# EAGLE design PIC_assembler_proto (EAGLE 9.6.0)
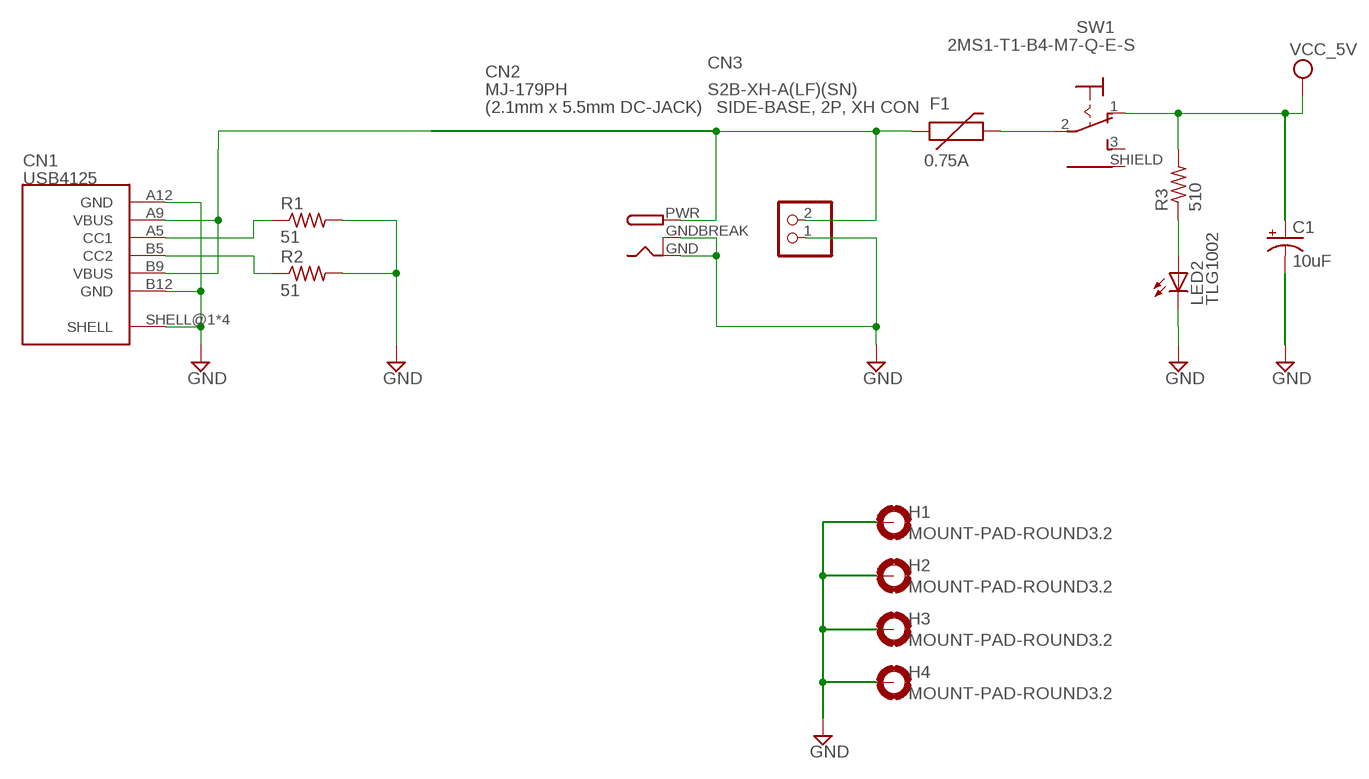
[diagram p0: schematic, sheet 1, part 1 of 2]
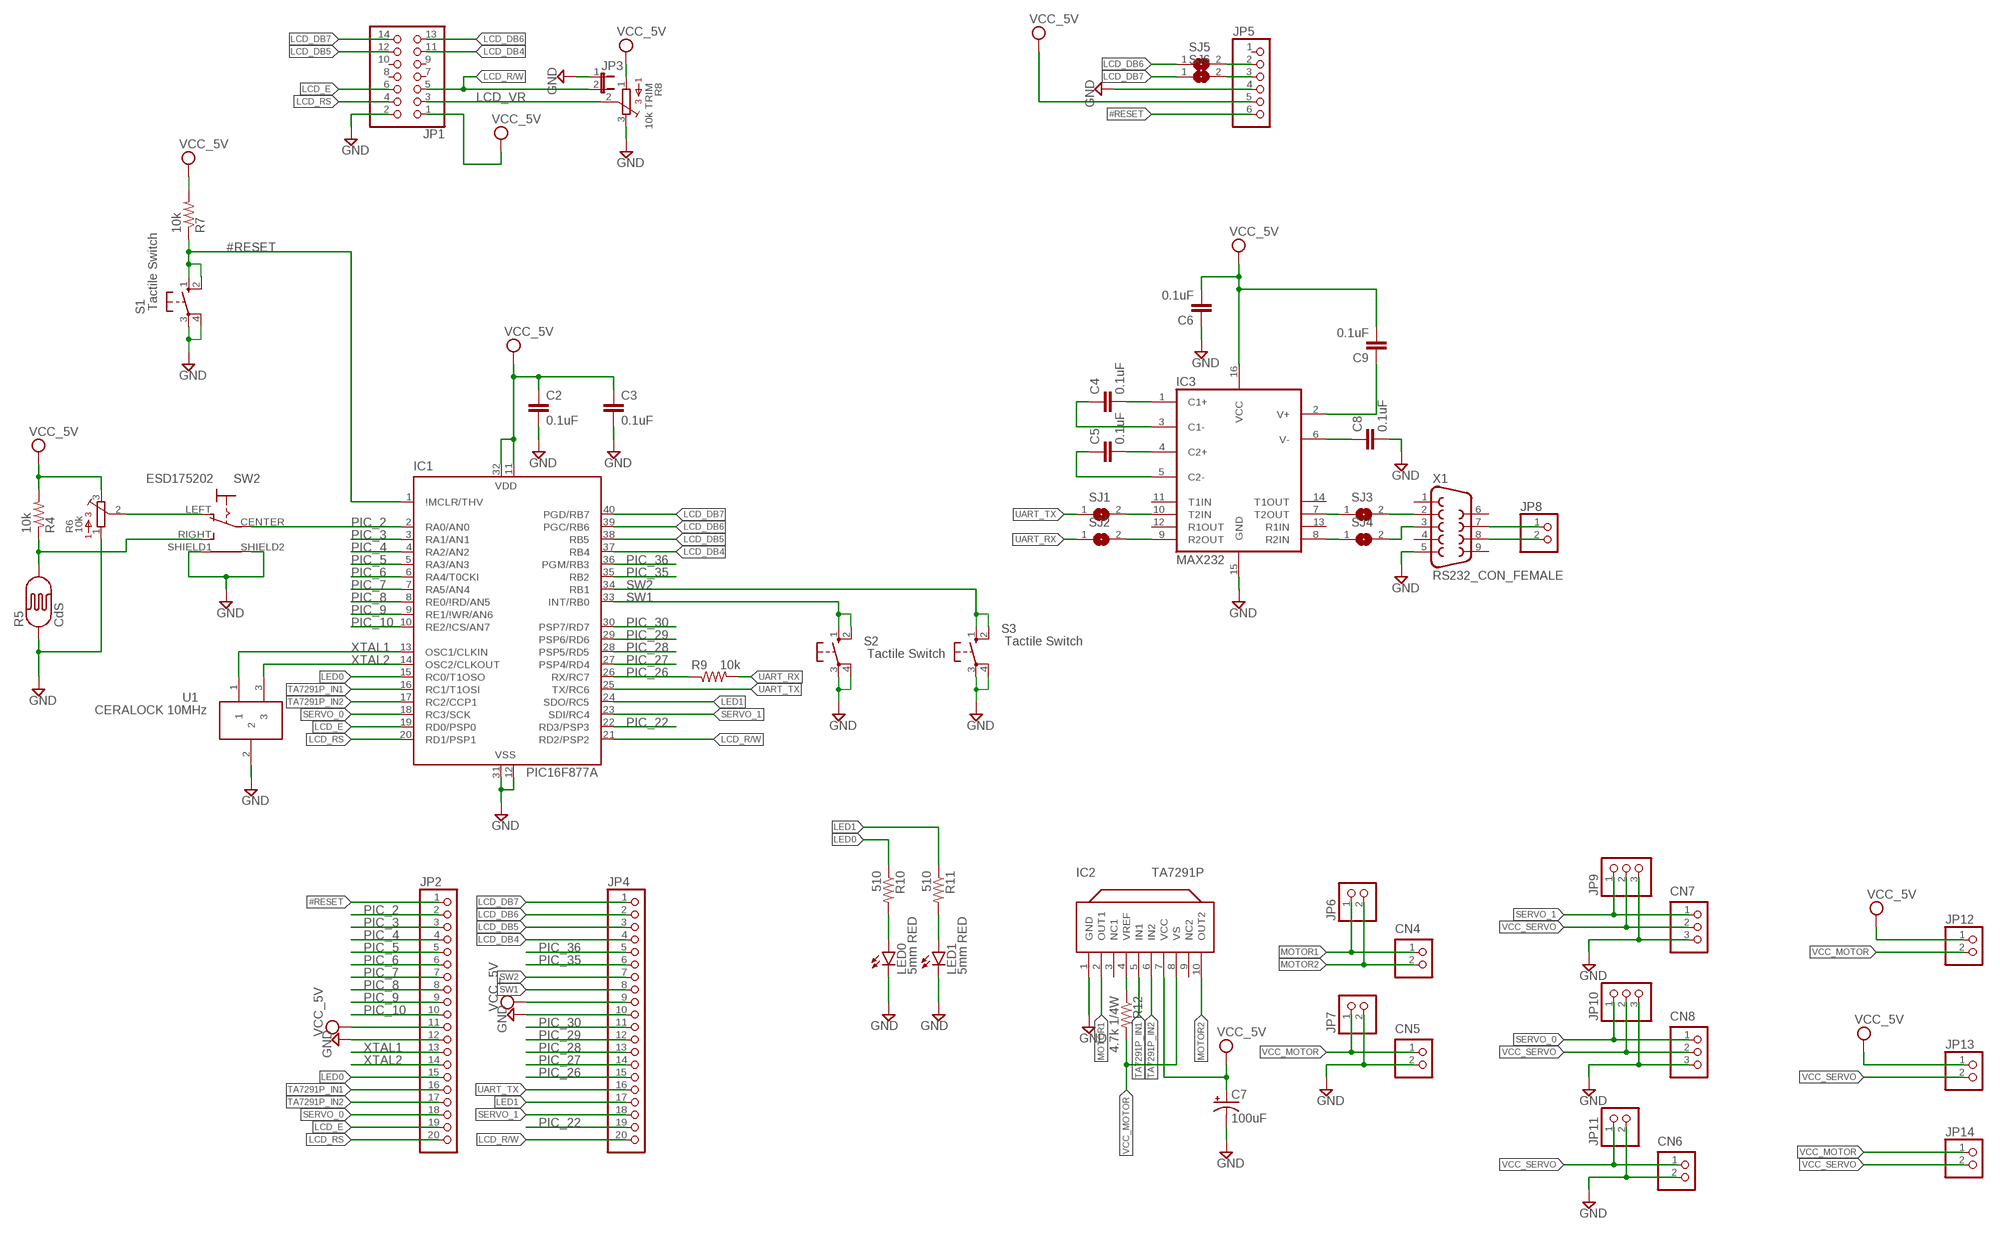
[diagram p1: schematic, sheet 1, part 2 of 2]

## Parts
C1  10uF  CPOL-USE2.5-7  [E2,5-7]
C2  0.1uF  C-EU050-025X075  [C050-025X075]
C3  0.1uF  C-EU050-025X075  [C050-025X075]
C4  0.1uF  C-EU050-025X075  [C050-025X075]
C5  0.1uF  C-EU050-025X075  [C050-025X075]
C6  0.1uF  C-EU050-025X075  [C050-025X075]
C7  100uF  CPOL-USE2.5-7  [E2,5-7]
C8  0.1uF  C-EU050-025X075  [C050-025X075]
C9  0.1uF  C-EU050-025X075  [C050-025X075]
CN1  USB4125  [USB4215]
CN2  MJ-179PH  DCBARREL  [DCJACK_2MM_THIN_18742]
CN3  S2B-XH-A(LF)(SN)  B2B-XH-A  [B2B-XH-A]
CN4  S2B-XH-A  [S2B-XH-A]
CN5  S2B-XH-A  [S2B-XH-A]
CN6  S2B-XH-A  [S2B-XH-A]
CN7  S3B-XH-A  [S3B-XH-A]
CN8  S3B-XH-A  [S3B-XH-A]
F1  0.75A  PTCPTH  [PTC]
H1  MOUNT-PAD-ROUND3.2  [3,2-PAD]
H2  MOUNT-PAD-ROUND3.2  [3,2-PAD]
H3  MOUNT-PAD-ROUND3.2  [3,2-PAD]
H4  MOUNT-PAD-ROUND3.2  [3,2-PAD]
IC1  PIC16F877A  PIC16F877P  [DIL40]
IC2  TA7291P  [SIL10]
IC3  MAX232  MAX232PTH  [DIL16]
JP1  PINHD-2X7  [2X07]
JP2  PINHD-1X20  [1X20]
JP3  JUMPER-2PTH  [1X02]
JP4  PINHD-1X20  [1X20]
JP5  PINHD-1X6/90  [1X06/90]
JP6  PINHD-1X2  [1X02]
JP7  PINHD-1X2  [1X02]
JP8  PINHD-1X2  [1X02]
JP9  PINHD-1X3  [1X03]
JP10  PINHD-1X3  [1X03]
JP11  PINHD-1X2  [1X02]
JP12  PINHD-1X2  [1X02]
JP13  PINHD-1X2  [1X02]
JP14  PINHD-1X2  [1X02]
LED0  5mm RED  LED5MM  [LED5MM]
LED1  5mm RED  LED5MM  [LED5MM]
LED2  TLG1002  LEDCHIPLED_0805  [CHIPLED_0805]
R1  51  R-US_R0603  [R0603]
R2  51  R-US_R0603  [R0603]
R3  510  R-US_0207/10  [0207/10]
R4  10k  R-US_0207/10  [0207/10]
R5  CdS  PHOTOCELLPTH  [PHOTOCELL]
R6  10k  3362P  [3362P]
R7  10k  R-US_0207/10  [0207/10]
R8  10k TRIM  3362P  [3362P]
R9  10k  R-US_0207/10  [0207/10]
R10  510  R-US_0207/10  [0207/10]
R11  510  R-US_0207/10  [0207/10]
R12  4.7k 1/4W  R-US_0207/10  [0207/10]
S1  Tactile Switch  10-XX  [B3F-10XX]
S2  Tactile Switch  10-XX  [B3F-10XX]
S3  Tactile Switch  10-XX  [B3F-10XX]
SJ1  SJ  [SJ]
SJ2  SJ  [SJ]
SJ3  SJ  [SJ]
SJ4  SJ  [SJ]
SJ5  SJ  [SJ]
SJ6  SJ  [SJ]
SW1  2MS1-T1-B4-M7-Q-E-S  [2MS1-T1-B4-M7-Q-E-S]
SW2  ESD175202  [ESD175202]
U1  CERALOCK 10MHz  CERALOCK  [CERALOCK]
X1  RS232_CON_FEMALE  DB9FEMALE  [DB9]

## Nets
#RESET: IC1.1(\!MCLR/THV) JP2.1 JP5.6 R7.1 S1.1(S) S1.2(S1)
GND: C1.- C2.2 C3.2 C6.1 C7.- C8.2 CN1.A12(GND) CN1.B12(GND) CN1.SHELL@1(SHELL) CN1.SHELL@2(SHELL) CN1.SHELL@3(SHELL) CN1.SHELL@4(SHELL) CN2.GND CN2.GNDBREAK CN3.1 CN5.2 CN6.2 CN7.3 CN8.3 H1.B3,2(MOUNT) H2.B3,2(MOUNT) H3.B3,2(MOUNT) H4.B3,2(MOUNT) IC1.12(VSS) IC1.31(VSS) IC2.1(GND) IC3.15(GND) JP1.2 JP2.12 JP3.1 JP4.10 JP5.4 JP7.2 JP9.3 JP10.3 JP11.2 LED0.K(C) LED1.K(C) LED2.C R1.2 R2.2 R5.1 R6.1 R8.3 S1.3(P) S1.4(P1) S2.3(P) S2.4(P1) S3.3(P) S3.4(P1) SW2.SHIELD1 SW2.SHIELD2 U1.2 X1.5
LCD_DB4: IC1.37(RB4) JP1.11 JP4.4
LCD_DB5: IC1.38(RB5) JP1.12 JP4.3
LCD_DB6: IC1.39(PGC/RB6) JP1.13 JP4.2 SJ5.1
LCD_DB7: IC1.40(PGD/RB7) JP1.14 JP4.1 SJ6.1
LCD_E: IC1.19(RD0/PSP0) JP1.6 JP2.19
LCD_R/W: IC1.21(RD2/PSP2) JP1.5 JP3.2 JP4.20
LCD_RS: IC1.20(RD1/PSP1) JP1.4 JP2.20
LCD_VR: JP1.3 R8.2
LED0: IC1.15(RC0/T1OSO) JP2.15 R10.1
LED1: IC1.24(SDO/RC5) JP4.17 R11.1
MOTOR1: CN4.1 IC2.2(OUT1) JP6.1
MOTOR2: CN4.2 IC2.10(OUT2) JP6.2
N$1: JP8.1 X1.7
N$2: SJ3.2 X1.2
N$3: IC3.9(R2OUT) SJ2.2
N$4: R4.1 R5.2 SW2.RIGHT(O2)
N$5: R6.2 SW2.LEFT(O1)
N$6: IC3.8(R2IN) SJ4.1
N$7: F1.P$2 SW1.2(2COMM)
N$8: IC3.10(T2IN) SJ1.2
N$9: JP8.2 X1.8
N$10: IC2.4(VREF) R12.1
N$11: JP5.2 SJ5.2
N$12: IC3.7(T2OUT) SJ3.1
N$13: JP5.3 SJ6.2
N$14: SJ4.2 X1.3
N$15: LED0.A R10.2
N$16: LED1.A R11.2
N$17: C9.1 IC3.2(V+)
N$18: C8.1 IC3.6(V-)
N$20: C5.2 IC3.4(C2+)
N$21: C5.1 IC3.5(C2-)
N$22: C4.1 IC3.3(C1-)
N$23: C4.2 IC3.1(C1+)
N$24: CN1.A9(VBUS) CN1.B9(VBUS) CN2.PWR CN3.2 F1.P$1
N$27: LED2.A R3.1
N$66: CN1.B5(CC2) R2.1
N$67: CN1.A5(CC1) R1.1
PIC_2: IC1.2(RA0/AN0) JP2.2 SW2.CENTER(COMMON)
PIC_3: IC1.3(RA1/AN1) JP2.3
PIC_4: IC1.4(RA2/AN2) JP2.4
PIC_5: IC1.5(RA3/AN3) JP2.5
PIC_6: IC1.6(RA4/T0CKI) JP2.6
PIC_7: IC1.7(RA5/AN4) JP2.7
PIC_8: IC1.8(RE0/\!RD/AN5) JP2.8
PIC_9: IC1.9(RE1/\!WR/AN6) JP2.9
PIC_10: IC1.10(RE2/\!CS/AN7) JP2.10
PIC_22: IC1.22(RD3/PSP3) JP4.19
PIC_26: IC1.26(RX/RC7) JP4.15 R9.1
PIC_27: IC1.27(PSP4/RD4) JP4.14
PIC_28: IC1.28(PSP5/RD5) JP4.13
PIC_29: IC1.29(PSP6/RD6) JP4.12
PIC_30: IC1.30(PSP7/RD7) JP4.11
PIC_35: IC1.35(RB2) JP4.6
PIC_36: IC1.36(PGM/RB3) JP4.5
SERVO_0: CN8.1 IC1.18(RC3/SCK) JP2.18 JP10.1
SERVO_1: CN7.1 IC1.23(SDI/RC4) JP4.18 JP9.1
SW1: IC1.33(INT/RB0) JP4.8 S2.1(S) S2.2(S1)
SW2: IC1.34(RB1) JP4.7 S3.1(S) S3.2(S1)
TA7291P_IN1: IC1.16(RC1/T1OSI) IC2.5(IN1) JP2.16
TA7291P_IN2: IC1.17(RC2/CCP1) IC2.6(IN2) JP2.17
UART_RX: R9.2 SJ2.1
UART_TX: IC1.25(TX/RC6) JP4.16 SJ1.1
VCC_5V: C1.+ C2.1 C3.1 C6.2 C7.+ C9.2 IC1.11(VDD) IC1.32(VDD) IC2.7(VCC) IC3.16(VCC) JP1.1 JP2.11 JP4.9 JP5.5 JP12.1 JP13.1 R3.2 R4.2 R6.3 R7.2 R8.1 SW1.1
VCC_MOTOR: CN5.1 IC2.8(VS) JP7.1 JP12.2 JP14.1 R12.2
VCC_SERVO: CN6.1 CN7.2 CN8.2 JP9.2 JP10.2 JP11.1 JP13.2 JP14.2
XTAL1: IC1.13(OSC1/CLKIN) JP2.13 U1.1
XTAL2: IC1.14(OSC2/CLKOUT) JP2.14 U1.3
Unconnected: IC2.3(NC1) IC2.9(NC2) IC3.11(T1IN) IC3.12(R1OUT) IC3.13(R1IN) IC3.14(T1OUT) JP1.7 JP1.8 JP1.9 JP1.10 JP5.1 SW1.3 SW1.SHIELD X1.1 X1.4 X1.6 X1.9

## Notes on the sheet
- (2.1mm x 5.5mm DC-JACK) | SIDE-BASE, 2P, XH CON

## Library data of the parts
C1 C7 = rcl:CPOL-US: POLARIZED CAPACITOR, American symbol; SPICEPREFIX: C
C2-C6 C8 C9 = rcl:C-EU: CAPACITOR, European symbol; SPICEPREFIX: C
CN1 = 11MyLib:USB4125: USB4125-GF-A-0190 USB Type-C Power only Series Connector Charging Only, 3A, Top mount, Horizontal, 6-pin Available in Digikey https://mm.digikey.com/Volume0/opasdata/d220001/medias/docus/5337/USB_Type-C_Selection_Guide.pdf https://www.digikey.jp/ja/products/detail/gct/USB4125-GF-A-0190/14559038
CN2 = 11MyLib:DCBARREL: 2.0mm DC Barrel Jack DCJACK_2MM_PTH - Through Hole Jack (4UConnector: 05537)
CN3 = jst-xh:B2B-XH-A: Wire-to-Board 2.5mm pitch top mount connector Source: http://www.jst-mfg.com/product/pdf/jpn/XH.pdf http://www.jst-mfg.com/product/detail.php?series=277
CN4-CN6 = jst-xh:S2B-XH-A: Wire-to-Board 2.5mm pitch side mount connector Source: http://www.jst-mfg.com/product/pdf/jpn/XH.pdf http://www.jst-mfg.com/product/detail.php?series=277
CN7 CN8 = jst-xh:S3B-XH-A: Wire-to-Board 2.5mm pitch side mount connector Source: http://www.jst-mfg.com/product/pdf/jpn/XH.pdf http://www.jst-mfg.com/product/detail.php?series=277
F1 = SparkFun-PowerIC:PTC: Resettable Fuse PTC Resettable Fuse. Spark Fun Electronics SKU : COM-08357
H1-H4 = holes:MOUNT-PAD-ROUND: MOUNTING PAD, round
IC1 = microchip-update-2:PIC16F87*: MICROCONTROLLER
IC2 = 11MyLib:TA7291P
IC3 = SparkFun-DigitalIC:MAX232: RS232 Transceiver Very common IC. This is generically called 'MAX232', but works with the 3V equivalent MAX3232 generic ICs. Field tested and mother approved. Spark Fun Electronics SKU : COM-00316 (DIP) and COM-00589 (SMD)
JP1 = pinhead:PINHD-2X7: PIN HEADER
JP2 JP4 = pinhead:PINHD-1X20: PIN HEADER
JP3 = SparkFun-Passives:JUMPER-2: Jumper Basic 0.1" spaced jumper. Use with breakaway headers.
JP5 = pinhead:PINHD-1X6: PIN HEADER
JP6-JP8 JP11-JP14 = pinhead:PINHD-1X2: PIN HEADER
JP9 JP10 = pinhead:PINHD-1X3: PIN HEADER
LED0 LED1 = led:LED: LED
LED2 = adafruit:LED: LED
R1-R4 R7 R9 = 11MyLib:R-US_: RESISTOR, American symbol
R5 = SparkFun-Sensors:PHOTOCELL: CdS photoresistor. This is a low cost way to detect light levels. Resistance decreases with more incoming light. SparkFun SKU: SEN-09088
R6 R8 = bourns:3362: 3362 Series 1/4" Square Trimmer
R10-R12 = rcl:R-US_: RESISTOR, American symbol; SPICEPREFIX: R
S1-S3 = switch-omron:10-XX: OMRON SWITCH; MPN: B3F-1000; OC_FARNELL: 176432; OC_NEWARK: 36M3542
SJ1-SJ6 = jumper:SJ: SMD solder JUMPER
SW1 = 11MyLib:2MS1-T1-B4-M7-Q-E-S: Toggle SW Alternate
SW2 = 11MyLib:ESD175202
U1 = ceralock:CERALOCK
X1 = SparkFun-Connectors:DB9: DB9 Connector Standard DB9 (D-Sub 9) serial connector. Can be used for CAN bus as well as RS485 and RS232. Footprint production proven. Spark Fun Electronics SKU : PRT-00429

## Board
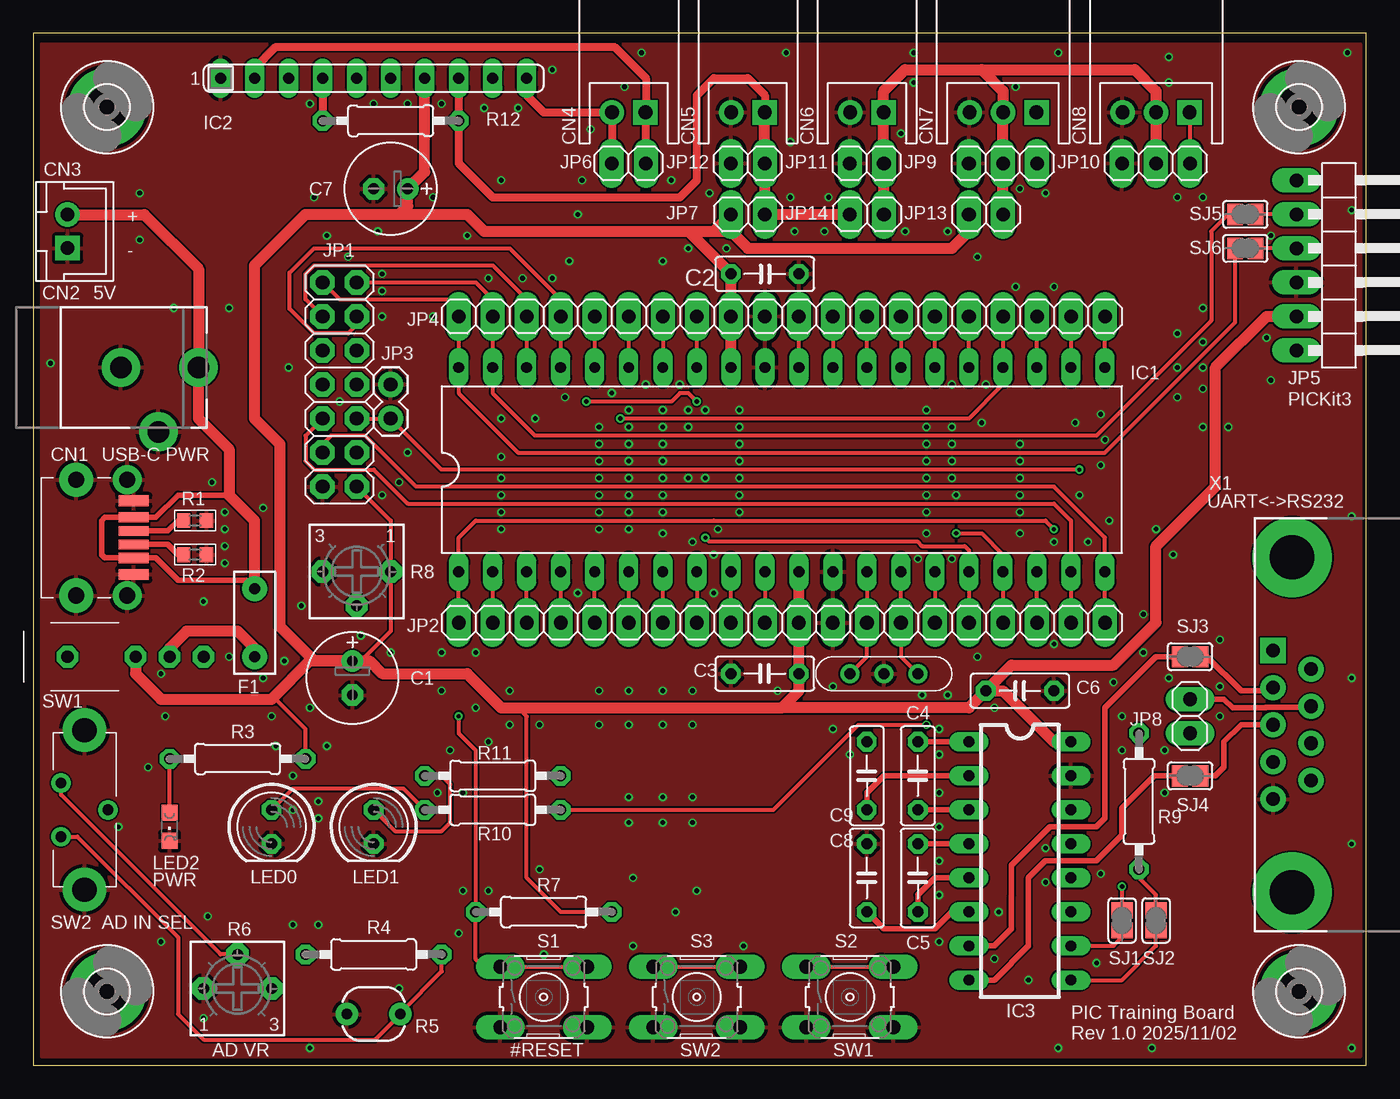
[diagram p2: board, top side]
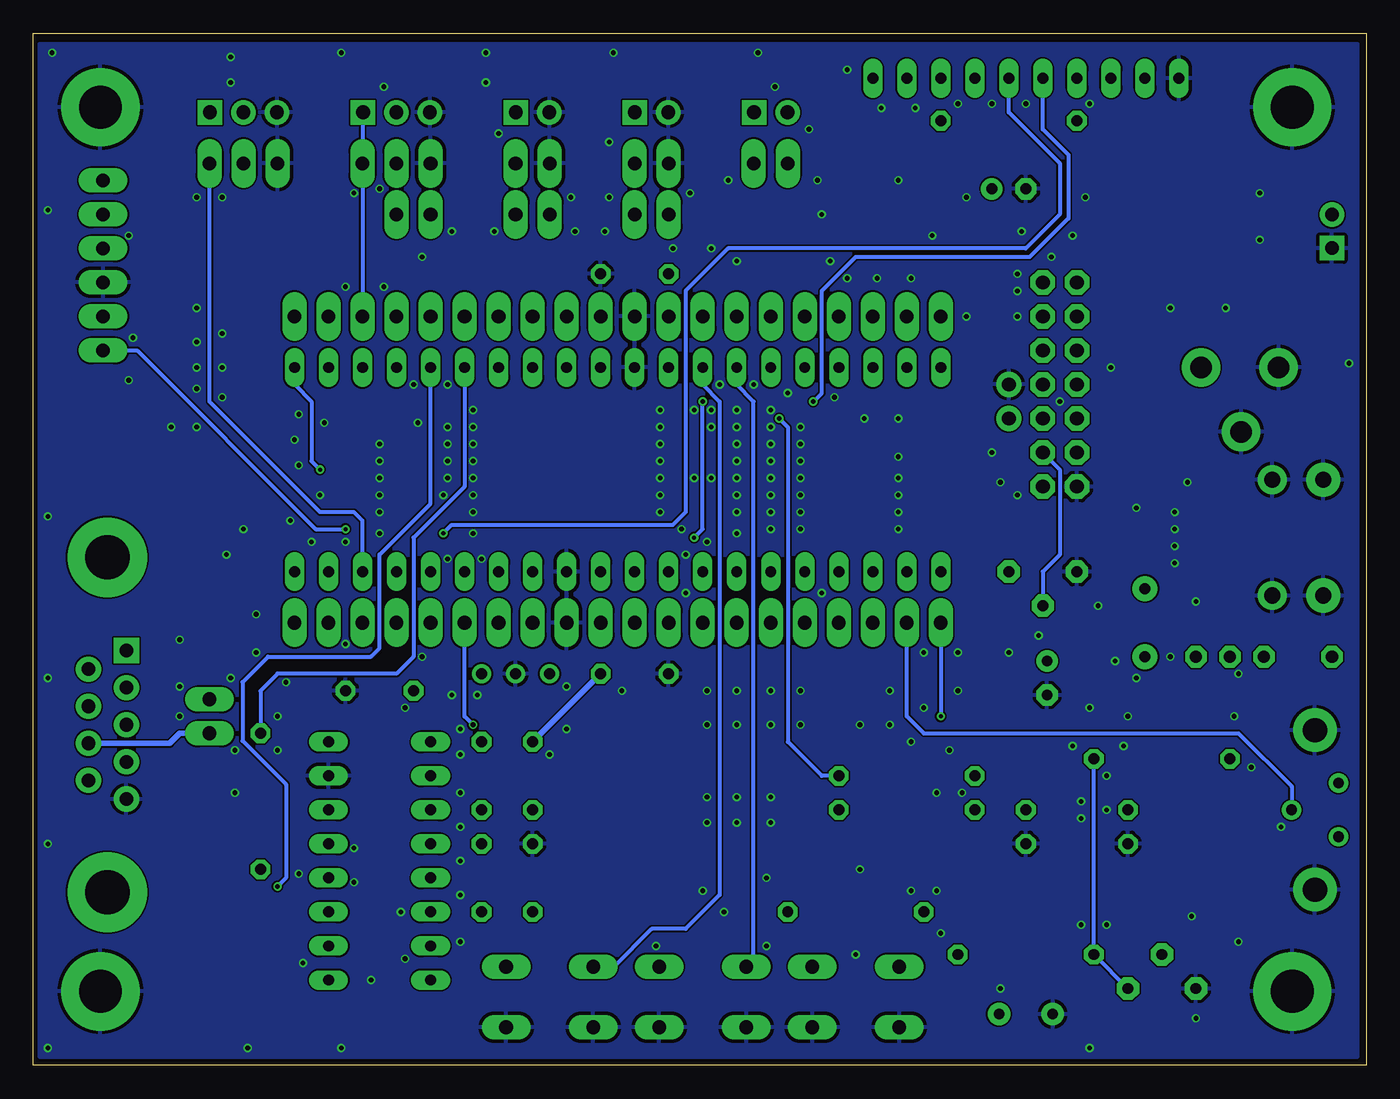
[diagram p3: board, bottom side, seen from below]

Size 99.5 x 77 mm. Coordinates in mm from the lower left corner, seen from the top.
Outline: 0,0 99.5,0 99.5,77 0,77 0,0
Copper layers (1*16): Top 0.035mm / dielectric 1.6mm / Bottom 0.035mm
Design rules "jlcpcb-2layers": minimum track width 5mil, minimum drill 0.3mm, track to track 5mil, track to pad 5mil, pad to pad 5mil, via to via 5mil, smd to smd 5mil, copper to edge 0.2mm, drill to drill 6mil, minimum pad ring 10mil, minimum via ring 3mil, stop-mask expansion 4mil, vias tented up to drill 0mil, thermal gap 10mil

### Footprints (pad centres in the part's own frame; a part is rotated, then mirrored left to right if it is on the bottom)
E2,5-7 = drill 0.813 pad 1.6: + -1.27,0 | drill 0.813 pad 1.6 octagon: - 1.27,0
C050-025X075 = drill 0.813 octagon: 1 -2.54,0; 2 2.54,0
USB4215 = smd 0.7 x 2.25: A5 -0.5,0.5; B5 0.5,0.5 | smd 0.76 x 2.25: A9 1.52,0.5; B9 -1.52,0.5 | smd 0.8 x 2.25: A12 2.75,0.5; B12 -2.75,0.5 | drill 1.2: SHELL@1 4.32,0; SHELL@2 -4.32,0 | drill 1.2 pad 2.54: SHELL@3 -4.32,-3.8; SHELL@4 4.32,-3.8
DCJACK_2MM_THIN_18742 = drill 1.6: GND 0,7.8; GNDBREAK 4.8,10.6; PWR 0,13.6
B2B-XH-A = drill 1.016 square: 1 -1.25,0 | drill 1.016: 2 1.25,0
S2B-XH-A = drill 1.016 square: 1 1.25,0 | drill 1.016: 2 -1.25,0
S3B-XH-A = drill 1.016 square: 1 2.5,0 | drill 1.016: 2 0,0; 3 -2.5,0
PTC = drill 0.8 pad 1.88: P$1 -2.54,0; P$2 2.54,0
3,2-PAD = drill 3.2 pad 5.842: B3,2 0,0
DIL40 = drill 0.813 long: 1 -24.13,-7.62; 2 -21.59,-7.62; 3 -19.05,-7.62; 4 -16.51,-7.62; 5 -13.97,-7.62; 6 -11.43,-7.62; 7 -8.89,-7.62; 8 -6.35,-7.62; 9 -3.81,-7.62; 10 -1.27,-7.62; 11 1.27,-7.62; 12 3.81,-7.62; 13 6.35,-7.62; 14 8.89,-7.62; 15 11.43,-7.62; 16 13.97,-7.62; 17 16.51,-7.62; 18 19.05,-7.62; 19 21.59,-7.62; 20 24.13,-7.62; 21 24.13,7.62; 22 21.59,7.62; 23 19.05,7.62; 24 16.51,7.62; 25 13.97,7.62; 26 11.43,7.62; 27 8.89,7.62; 28 6.35,7.62; 29 3.81,7.62; 30 1.27,7.62; 31 -1.27,7.62; 32 -3.81,7.62; 33 -6.35,7.62; 34 -8.89,7.62; 35 -11.43,7.62; 36 -13.97,7.62; 37 -16.51,7.62; 38 -19.05,7.62; 39 -21.59,7.62; 40 -24.13,7.62
SIL10 = drill 0.813 long: 1 -11.43,0; 2 -8.89,0; 3 -6.35,0; 4 -3.81,0; 5 -1.27,0; 6 1.27,0; 7 3.81,0; 8 6.35,0; 9 8.89,0; 10 11.43,0
DIL16 = drill 0.813 long: 1 -8.89,-3.81; 2 -6.35,-3.81; 3 -3.81,-3.81; 4 -1.27,-3.81; 5 1.27,-3.81; 6 3.81,-3.81; 7 6.35,-3.81; 8 8.89,-3.81; 9 8.89,3.81; 10 6.35,3.81; 11 3.81,3.81; 12 1.27,3.81; 13 -1.27,3.81; 14 -3.81,3.81; 15 -6.35,3.81; 16 -8.89,3.81
2X07 = drill 1.016 octagon: 1 -7.62,-1.27; 2 -7.62,1.27; 3 -5.08,-1.27; 4 -5.08,1.27; 5 -2.54,-1.27; 6 -2.54,1.27; 7 0,-1.27; 8 0,1.27; 9 2.54,-1.27; 10 2.54,1.27; 11 5.08,-1.27; 12 5.08,1.27; 13 7.62,-1.27; 14 7.62,1.27
1X20 = drill 1.016 long: 1 -24.13,0; 2 -21.59,0; 3 -19.05,0; 4 -16.51,0; 5 -13.97,0; 6 -11.43,0; 7 -8.89,0; 8 -6.35,0; 9 -3.81,0; 10 -1.27,0; 11 1.27,0; 12 3.81,0; 13 6.35,0; 14 8.89,0; 15 11.43,0; 16 13.97,0; 17 16.51,0; 18 19.05,0; 19 21.59,0; 20 24.13,0
1X02 = drill 1.016 pad 1.88: 1 0,0; 2 2.54,0
1X06/90 = drill 1.016 long: 1 -6.35,-3.81; 2 -3.81,-3.81; 3 -1.27,-3.81; 4 1.27,-3.81; 5 3.81,-3.81; 6 6.35,-3.81
1X02' = drill 1.016 long: 1 -1.27,0; 2 1.27,0
1X03 = drill 1.016 long: 1 -2.54,0; 2 0,0; 3 2.54,0
LED5MM = drill 0.813 octagon: A -1.27,0; K 1.27,0
CHIPLED_0805 = smd 1.2 x 1.2: A 0,-1.05; C 0,1.05
R0603 = smd 1 x 1.1: 1 -0.85,0; 2 0.85,0
0207/10 = drill 0.813 octagon: 1 -5.08,0; 2 5.08,0
PHOTOCELL = drill 0.8 pad 1.676: 1 -2,0; 2 2,0
3362P = drill 0.813 pad 1.676 octagon: 1 -2.54,0; 2 0,2.54; 3 2.54,0
B3F-10XX = drill 1.016 long: 1 -3.251,2.261; 2 3.251,2.261; 3 -3.251,-2.261; 4 3.251,-2.261
SJ = smd 1.168 x 1.6: 1 -0.762,0; 2 0.762,0
2MS1-T1-B4-M7-Q-E-S = drill 0.9 octagon: 1 0,0; 2 2.54,0; 3 5.08,0; SHIELD -5.08,0
ESD175202 = drill 0.8: CENTER 0,-1.75; LEFT 2,1.75; RIGHT -2,1.75 | drill 1.8: SHIELD1 -5.95,0; SHIELD2 5.95,0
CERALOCK = drill 0.8: 1 0,0; 2 2.54,0; 3 5.08,0
DB9 = drill 1.016 pad 1.88 square: 1 -5.54,-1.42 | drill 1.016 pad 1.88: 2 -2.77,-1.42; 3 0,-1.42; 4 2.77,-1.42; 5 5.54,-1.42; 6 -4.15,1.42; 7 -1.38,1.42; 8 1.38,1.42; 9 4.15,1.42 | drill 3.302 pad 5.08: G1 -12.5,0; G2 12.5,0

### Placement (x,y rotation side)
C1  23.81,28.89 270 top
C2  54.61,59.05 0 top
C3  54.61,29.21 180 top
C4  66.04,21.59 90 top
C5  66.04,13.97 90 top
C6  73.66,27.94 180 top
C7  26.67,65.41 180 top
C8  62.23,13.97 90 top
C9  62.23,21.59 90 top
CN1  6.99,39.37 270 top
CN2  -1.27,52.07 270 top
CN3  2.54,62.23 90 top
CN4  44.45,71.12 0 top
CN5  53.34,71.12 0 top
CN6  62.23,71.12 0 top
CN7  72.39,71.12 0 top
CN8  83.82,71.12 0 top
F1  16.51,33.02 270 top
H1  94.5,71.5 0 top
H2  94.5,5.5 0 top
H3  5.5,71.5 0 top
H4  5.5,5.5 0 top
IC1  55.88,44.45 0 top
IC2  25.4,73.66 0 top
IC3  73.66,15.24 270 top
JP1  22.86,50.8 90 top
JP2  55.88,33.02 0 top
JP3  26.67,50.8 270 top
JP4  55.88,55.88 0 top
JP5  98.11,59.69 270 top
JP6  [1X02']  44.45,67.31 180 top
JP7  [1X02']  53.34,67.31 180 top
JP8  [1X02']  86.36,26.04 270 top
JP9  72.39,67.31 180 top
JP10  83.82,67.31 180 top
JP11  [1X02']  62.23,67.31 180 top
JP12  [1X02']  53.34,63.5 0 top
JP13  [1X02']  71.12,63.5 0 top
JP14  [1X02']  62.23,63.5 0 top
LED0  17.78,17.78 270 top
LED1  25.4,17.78 270 top
LED2  10.16,17.78 180 top
R1  12.06,40.64 0 top
R2  12.06,38.1 0 top
R3  15.24,22.86 0 top
R4  25.4,8.26 180 top
R5  25.4,3.81 0 top
R6  15.24,5.71 0 top
R7  38.1,11.43 0 top
R8  24.13,36.83 180 top
R9  82.55,19.68 270 top
R10  34.29,19.05 180 top
R11  34.29,21.59 180 top
R12  26.67,70.48 0 top
S1  38.1,5.08 0 top
S2  60.96,5.08 0 top
S3  49.53,5.08 0 top
SJ1  81.28,10.79 270 top
SJ2  83.82,10.79 270 top
SJ3  86.36,30.48 0 top
SJ4  86.36,21.59 0 top
SJ5  90.49,63.5 0 top
SJ6  90.49,60.96 0 top
SW1  7.62,30.48 0 top
SW2  3.81,19.05 90 top
U1  60.96,29.21 0 top
X1  93.98,25.4 270 top

### Tracks (layer width: path | path; a pad name or v marks a point on that pad's centre or on a via)
#RESET  (via drill 0.3 pad 0.61)
  Top 0.305: S1.2 S1.1 33.58,7.34 33.02,7.9 R7.1 33.02,23.5 31.75,24.77 v31.75,26.04 | JP2.1 IC1.1 31.75,39.37 33.02,40.64 50.8,40.64 75.56,40.64 v76.2,40.01
  Bottom 0.305: JP2.1 v31.75,26.04 | v76.2,40.01 78.42,40.01 91.76,53.34 JP5.6
GND  (via drill 0.35 pad 0.61)
  other vias: 14.29,41.27 14.29,40.01 14.29,38.73 14.29,37.47 17.14,41.59 20.64,71.75 25.4,71.75 25.72,62.23 21.91,61.91 19.05,52.07 26.04,55.88 29.84,55.88 26.04,59.05 26.04,57.78 23.5,60.33 32.38,61.91 29.84,64.77 30.48,71.75 27.94,71.75 33.66,71.44 36.2,71.44 34.92,66.04 40.96,66.04 41.59,69.85 38.73,74.3 44.13,73.03 45.4,75.56 47.62,66.04 40.64,63.5 50.48,65.09 46.99,60.01 40.01,60.01 48.9,60.96 36.51,58.74 33.97,58.74 38.73,58.74 34.92,48.26 34.92,45.4 34.92,43.81 34.92,42.55 34.92,41.27 34.92,40.01 44.45,41.27 44.45,40.01 44.45,42.55 44.45,43.81 44.45,45.09 44.45,46.35 44.45,47.62 44.45,48.9 37.47,48.26 39.69,49.85 43.18,50.16 45.72,50.8 48.26,50.8 46.99,48.9 46.99,47.62 46.99,46.35 46.99,45.09 46.99,43.81 48.9,43.81 48.9,47.62 48.9,48.9 50.16,48.9 50.16,43.81 51.12,40.01 49.21,39.05 46.99,39.69 46.99,41.27 46.99,42.55 42.23,40.01 42.23,41.27 42.23,42.55 42.23,43.81 42.23,45.09 42.23,46.35 42.23,47.62 52.7,41.27 52.7,42.55 52.7,43.81 52.7,45.09 52.7,46.35 52.7,47.62 52.7,48.9 66.67,48.9 66.67,47.62 66.67,46.35 66.67,45.09 66.67,43.81 66.67,42.55 66.67,41.27 66.67,39.69 50.8,38.1 66.04,37.78 55.56,27.94 49.21,27.94 46.99,27.94 44.45,27.94 44.45,25.4 46.99,25.4 49.21,25.4 49.21,20 46.99,20 44.45,20 42.23,25.4 42.23,27.94 35.56,27.94 35.56,25.4 37.78,25.4 37.78,14.61 33.97,13.02 38.1,8.26 44.77,8.89 46.99,18.1 49.21,18.1 44.45,18.1 53.02,8.89 67.63,15.24 67.63,17.78 67.63,20.32 67.63,23.18 67.63,12.7 67.63,9.21 71.75,7.94 75.56,16.19 75.56,13.65 79.69,14.29 79.38,7.62 84.45,20.32 84.45,23.5 81.28,23.5 81.28,26.04 71.75,26.67 67.63,25.08 66.36,27.62 68.26,27.62 70.48,30.48 76.2,31.43 82.87,33.66 80.64,28.57 82.87,30.8 85.09,38.1 83.82,40.01 78.74,39.05 76.2,39.05 73.66,39.69 73.66,41.27 73.66,42.55 73.66,43.81 73.66,45.09 73.66,46.35 70.8,47.94 77.79,47.94 79.69,48.58 79.69,44.77 78.11,42.55 80.33,40.64 85.41,49.85 87.31,50.48 87.31,47.62 89.22,47.62 92.39,51.12 87.31,53.98 92.39,61.91 80.01,46.67 73.66,65.41 73.34,73.03 84.77,73.34 85.41,64.77 75.56,65.09 76.2,58.1 73.34,58.1 65.09,62.23 68.26,62.23 64.77,69.53 65.72,73.34 65.72,75.56 76.52,75.56 84.77,75.25 56.2,75.56 56.52,68.9 56.52,64.77 59.37,64.77 51.75,60.96 56.83,62.23 59.05,62.23 70.48,60.33 71.12,50.8 68.58,50.8 68.58,47.62 68.58,46.35 68.58,45.09 68.58,43.81 68.9,42.55 98.42,40.96 98.42,16.51 98.42,1.27 83.5,1.27 76.52,1.27 87.31,64.77 98.11,75.56 98.42,63.82 87.31,56.52 85.41,54.61 85.41,52.07 98.42,28.89 20.64,1.27 12.7,3.49 31.75,9.84 21.27,18.41 19.37,19.05 6.35,17.78 13.02,11.11 9.53,9.21 17.78,26.04 20.64,26.67 21.91,23.81 18.1,23.81 21.27,19.68 19.37,21.59 17.14,28.89 18.73,30.16 14.61,30.48 9.53,29.21 20,34.29 24.45,32.07 26.67,30.8 30.48,27.94 30.48,30.8 33.02,30.8 33.02,26.67 31.11,23.5 21.27,10.48 33.97,24.13 14.61,56.52 10.48,56.52 7.94,61.59 7.94,65.09 1.27,52.39 20.95,64.77 13.34,43.5 27.94,45.72 27.3,43.5 26.04,42.55 22.86,49.53 60.96,23.18 59.69,25.08 59.69,28.26 50.8,35.24 40.64,35.24 49.53,13.02 47.94,11.43 44.77,13.97 32.07,13.02 27.3,5.71 19.37,10.48 8.57,22.23 9.84,26.04 12.7,34.61 88.58,26.04 88.58,28.26 88.58,31.75 72.07,11.43 74.3,6.35 68.58,37.78 87.31,52.07 30.16,20.32 32.07,20.32 92.08,54.29 84.77,28.89
  pour Top: 0.64,76.2 99.06,76.2 99.06,0.64 0.64,0.64
  pour Bottom: 0.64,76.2 99.06,76.2 99.06,0.64 0.64,0.64
LCD_DB4
  Top 0.305: IC1.37 JP4.4 39.37,57.15 35.56,60.96 20.94,60.96 19.13,59.14 19.13,56.44 20.95,54.61 23.5,54.61 24.13,55.24 JP1.11
LCD_DB5
  Top 0.305: IC1.38 JP4.3 36.83,57.15 34.29,59.69 20.95,59.69 20.32,59.05 20.32,57.15 JP1.12
LCD_DB6
  Top 0.305: JP1.13 33.02,58.42 34.29,57.15 JP4.2 IC1.39 34.29,50.16 37.47,46.99 79.38,46.99 87.95,55.56 87.95,62.23 89.22,63.5 SJ5.1
LCD_DB7
  Top 0.305: JP1.14 22.86,57.15 31.11,57.15 31.75,56.52 JP4.1 IC1.40 31.75,50.16 36.2,45.72 80.01,45.72 89.72,55.44 SJ6.1
LCD_E
  Top 0.305: JP2.19 IC1.19 77.47,40.64 76.2,41.91 27.94,41.91 25.4,44.45 20.95,44.45 20.32,45.09 20.32,46.99 JP1.6
LCD_R/W  (via drill 0.3 pad 0.61)
  Top 0.305: IC1.21 JP4.20 | JP1.5 JP3.2 30.48,44.45 v78.11,44.45
  Bottom 0.305: v78.11,44.45 78.74,45.09 78.74,49.53 80.01,50.8 IC1.21
LCD_RS
  Top 0.305: JP2.20 IC1.20 80.01,39.37 76.2,43.18 28.57,43.18 24.77,46.99 22.23,46.99 21.59,46.35 JP1.4
LCD_VR
  Bottom 0.305: JP1.3 22.86,44.45 22.86,38.1 24.13,36.83 R8.2
LED0  (via drill 0.35 pad 0.61)
  Top 0.305: IC1.15 JP2.15 | R10.1 55.24,19.05 61.59,25.4 v66.67,25.4
  Bottom 0.305: v66.67,25.4 67.31,26.04 JP2.15
LED1  (via drill 0.3 pad 0.61)
  Top 0.305: JP4.17 IC1.24 72.39,50.8 69.85,48.26 v43.81,48.26
  Bottom 0.305: R11.1 40.64,21.59 43.18,24.13 43.18,47.62 v43.81,48.26
MOTOR1
  Top 0.61: JP6.1 45.7,67.33 CN4.1 45.72,71.14 45.72,73.66 43.38,76 18.1,76 16.51,74.41 IC2.2
MOTOR2
  Top 0.61: JP6.2 43.2,67.33 CN4.2 38.1,71.12 36.83,72.39 IC2.10
N$1
  Top 0.406: JP8.1 88.9,27.3 89.53,26.67 92,26.67 92.02,26.7 95.31,26.7 X1.7
N$2
  Top 0.406: X1.2 92.33,27.94 90.17,27.94 87.63,30.48 SJ3.2
N$3
  Top 0.305: IC3.9 81.28,6.35 83.82,8.89 SJ2.2
N$4
  Top 0.305: R4.1 30.48,6.99 27.4,3.9 R5.2 25.5,1.91 12.7,1.91 10.79,3.81 10.79,9.53 3.27,17.05 SW2.RIGHT
N$5
  Top 0.305: R6.2 13.97,8.26 2.06,20.16 SW2.LEFT
N$6
  Top 0.406: SJ4.1 83.69,21.59 81.28,19.18 81.28,17.14 79.38,15.24 75.56,15.24 74.3,13.97 74.3,8.89 71.75,6.35 IC3.8
N$7
  Top 0.813: F1.P$2 16.51,31.11 15.24,32.38 11.43,32.38 10.16,31.11 SW1.2
N$8
  Top 0.305: IC3.10 80.64,8.89 81.28,9.53 SJ1.2
N$9
  Bottom 0.406: X1.8 89.33,24.02 88.58,24.77 JP8.2
N$10
  Top 0.61: IC2.4 R12.1
N$11
  Top 0.305: JP5.2 SJ5.2
N$12
  Top 0.406: IC3.7 71.75,8.89 73.03,10.16 73.03,12.7 73.03,14.92 75.88,17.78 79.38,17.78 80.01,18.41 80.01,26.67 83.82,30.48 SJ3.1
N$13
  Top 0.305: JP5.3 SJ6.2
N$14
  Top 0.406: X1.3 90.17,25.4 88.9,24.13 88.9,22.23 88.27,21.59 SJ4.2
N$15
  Top 0.305: LED0.A 19.37,20.64 27.62,20.64 R10.2
N$16
  Top 0.305: LED1.A 26.99,17.46 30.48,17.46 31.11,18.1 31.11,20.95 30.48,21.59 R11.2
N$17
  Top 0.406: IC3.2 63.5,21.59 62.23,20.32 C9.1
N$18
  Top 0.406: C8.1 63.5,10.16 67.31,10.16 68.58,11.43 IC3.6
N$20
  Top 0.406: IC3.4 C5.2
N$21
  Top 0.406: IC3.5 67.31,13.97 66.04,12.7 C5.1
N$22
  Top 0.406: IC3.3 C4.1
N$23
  Top 0.406: IC3.1 C4.2
N$24
  Top 0.406: F1.P$1 15.88,36.2 10.79,36.2 9.14,37.85 CN1.A9 5.33,37.85 5.08,38.1 5.08,40.64 5.33,40.89 CN1.B9 9.14,40.89 10.79,42.55 14.61,42.55
  Top 0.813: F1.P$1 16.51,40.64 14.61,42.55 14.61,45.98 12.33,48.26 CN2.PWR 12.33,59.42 8.28,63.48 CN3.2
N$27
  Top 0.305: LED2.A R3.1
N$66
  Top 0.406: CN1.B5 10.03,38.87 10.79,38.1 R2.1
N$67
  Top 0.406: CN1.A5 10.03,39.87 10.79,40.64 R1.1
PIC_2
  Top 0.305: IC1.2 JP2.2
  Bottom 0.305: JP2.2 34.29,26.04 33.02,24.77 24.13,24.77 9.53,24.77 5.56,20.8 SW2.CENTER
PIC_3
  Top 0.305: JP2.3 IC1.3
PIC_4
  Top 0.305: IC1.4 JP2.4
PIC_5
  Top 0.305: JP2.5 IC1.5
PIC_6
  Top 0.305: IC1.6 JP2.6
PIC_7
  Top 0.305: JP2.7 IC1.7
PIC_8
  Top 0.305: IC1.8 JP2.8
PIC_9
  Top 0.305: JP2.9 IC1.9
PIC_10
  Top 0.305: IC1.10 JP2.10
PIC_22
  Top 0.305: JP4.19 IC1.22
PIC_26
  Top 0.305: IC1.26 JP4.15
  Bottom 0.305: IC1.26 67.31,43.18 71.12,39.37 71.12,30.48 72.39,29.21 81.28,29.21 82.55,27.94 R9.1
PIC_27
  Top 0.305: JP4.14 IC1.27
PIC_28
  Top 0.305: IC1.28 JP4.13
PIC_29
  Top 0.305: JP4.12 IC1.29
PIC_30
  Top 0.305: IC1.30 JP4.11
PIC_35
  Top 0.305: JP4.6 IC1.35
PIC_36
  Top 0.305: JP4.5 IC1.36
SERVO_0
  Top 0.305: CN8.1 86.36,71.08 JP10.1 | JP2.18 IC1.18
  Bottom 0.305: IC1.18 74.93,40.64 75.56,41.27 78.11,41.27 86.36,49.53 JP10.1
SERVO_1
  Top 0.305: IC1.23 JP4.18
  Bottom 0.305: CN7.1 74.93,71.08 JP9.1 JP4.18
SW1
  Top 0.305: S2.1 S2.2 | IC1.33 JP4.8
  Bottom 0.305: IC1.33 49.53,50.8 48.26,49.53 48.26,12.7 50.8,10.16 53.34,10.16 56.16,7.34 S2.1
SW2
  Top 0.305: S3.1 S3.2 | JP4.7 IC1.34
  Bottom 0.305: S3.1 45.72,7.9 45.72,49.53 46.99,50.8 IC1.34
TA7291P_IN1  (via drill 0.3 pad 0.61, 0.35 pad 0.61)
  Top 0.305: JP2.16 IC1.16 69.85,37.15 69.85,38.42 69.53,38.73 66.36,38.73 66,39.09 50.44,39.09 v50.16,39.37 | v49.53,49.53 48.9,50.16 48.26,50.16 47.62,49.53 v41.27,49.53
  Bottom 0.305: v50.16,39.37 49.53,40.01 v49.53,49.53 | v41.27,49.53 40.64,50.16 40.64,57.78 38.1,60.33 25.1,60.33 22.23,63.2 22.23,67.94 24.13,69.85 IC2.5
TA7291P_IN2  (via drill 0.3 pad 0.61)
  Top 0.305: JP2.17 IC1.17 72.39,38.1 70.8,39.69 v68.9,39.69
  Bottom 0.305: IC2.6 26.67,71.12 22.86,67.31 22.86,63.5 25.4,60.96 47.62,60.96 50.8,57.78 50.8,41.27 51.75,40.32 68.26,40.32 v68.9,39.69
UART_RX
  Top 0.305: SJ2.1 83.82,12.7 82.55,13.97 R9.2
UART_TX  (via drill 0.35 pad 0.61)
  Top 0.305: IC1.25 JP4.16 | v81.28,13.34 SJ1.1
  Bottom 0.305: IC1.25 69.85,41.91 73.66,38.1 73.66,31.11 74.3,30.48 81.99,30.48 83.9,28.57 83.9,24.21 80.64,20.95 80.64,13.97 v81.28,13.34
VCC_5V
  Top 0.305: JP1.1 26.67,40.64 R8.1 26.67,32.38 24.45,30.16 | R3.2 20.32,25.08 17.94,27.46 17.78,27.3 | R7.2 39.37,11.43 36.83,13.97 36.83,26.04 36.2,26.67
  Top 0.813: SW1.1 7.62,29.21 9.53,27.3 17.78,27.3 | IC2.7 29.21,66.67 C7.+ 27.94,64.14 27.3,63.5 | JP13.1 69.85,62.23 68.58,60.96 53.34,60.96 52.07,62.23 50.8,62.23 | 27.3,63.5 20.32,63.5 16.51,59.69 16.51,48.26 18.41,46.35 18.41,32.7 20.95,30.16 C1.+ | C1.+ 24.45,30.16 25.08,30.16 26.04,29.21 32.38,29.21 34.92,26.67 36.2,26.67 55.88,26.67 | 55.88,26.67 57.15,27.94 C3.1 JP2.11 IC1.11 | IC3.16 76.2,24.13 72.39,27.94 C6.2 | C6.2 69.85,26.67 55.88,26.67 | C6.2 73.03,29.84 80.64,29.84 83.82,33.02 83.82,38.73 88.27,43.18 88.27,52.07 92.08,55.88 JP5.5 | 17.94,27.46 20.64,30.16 C1.+ | 48.9,62.23 33.66,62.23 32.38,63.5 27.3,63.5 | 48.9,62.23 49.53,62.23 50.8,62.23 | 50.8,62.23 JP12.1 | 48.9,62.23 C2.1 JP4.9 IC1.32
  Bottom 0.305: R3.2 R4.2 R6.3
  Bottom 0.406: C9.2 C3.1
VCC_MOTOR
  Top 0.61: IC2.8 R12.2 31.75,67.31 34.29,64.77 48.26,64.77 49.53,66.04 49.53,72.39 50.8,73.66 53.34,73.66 54.61,72.39 54.61,71.14 CN5.1
  Top 0.813: JP14.1 JP12.2 JP7.1 54.59,67.33 CN5.1
VCC_SERVO
  Top 0.813: JP14.2 JP11.1 63.48,67.33 CN6.1 63.48,72.69 65.09,74.3 70.8,74.3 | JP10.2 CN8.2 83.82,72.71 82.23,74.3 70.8,74.3 | JP13.2 JP9.2 CN7.2 72.39,72.71 70.8,74.3
XTAL1
  Top 0.305: U1.1 62.23,30.48 JP2.13 IC1.13
XTAL2
  Top 0.305: U1.3 64.77,30.48 JP2.14 IC1.14

### Text on the board
tPlace: PWR | PIC Training Board / Rev 1.0 2025/11/02 | SW2 | SW1
tNames: + | - | 5V | PICKit3 | USB-C PWR | UART<->RS232 | AD IN SEL | AD VR | #RESET